# Altium schematic sheet [04] - USB PORTS.SchDoc
size A3; SheetNumber: 5; SheetTotal: 10
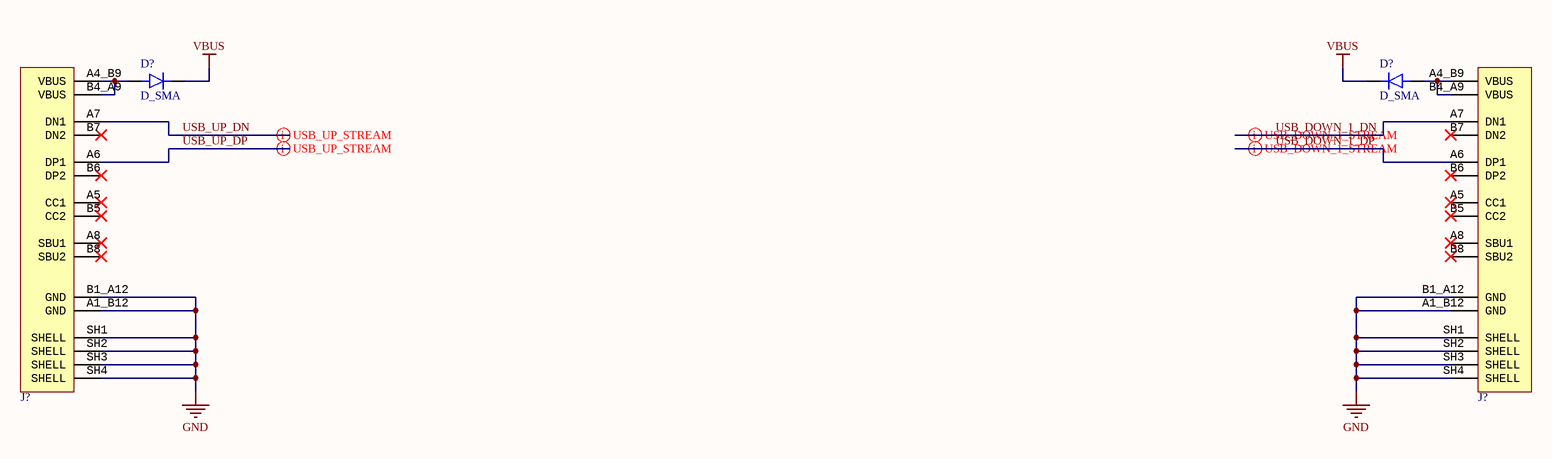
[diagram p0: [04] - USB PORTS.SchDoc]

## Parts
(Parts that share a designator on the sheet are numbered #1, #2 ... from top to bottom, then left to right.)
D?#1  D_SMA  [DO-214AC-2 (SMA)]
D?#2  D_SMA  [DO-214AC-2 (SMA)]
J?#1  CONN_USB_TYPEC_16PIN  [CONN_USB_TYPEC_16PIN]  (value not drawn)
J?#2  CONN_USB_TYPEC_16PIN  [CONN_USB_TYPEC_16PIN]  (value not drawn)

## Nets
GND: J?#1.A1_B12(GND) J?#1.B1_A12(GND) J?#1.SH1(SHELL) J?#1.SH2(SHELL) J?#1.SH3(SHELL) J?#1.SH4(SHELL) J?#2.A1_B12(GND) J?#2.B1_A12(GND) J?#2.SH1(SHELL) J?#2.SH2(SHELL) J?#2.SH3(SHELL) J?#2.SH4(SHELL)
VBUS: D?#1.K D?#2.K
USB_DOWN_1_DN: J?#2.A7(DN1)
USB_DOWN_1_DP: J?#2.A6(DP1)
USB_UP_DN: J?#1.A7(DN1)
USB_UP_DP: J?#1.A6(DP1)
NetD?#1_A: D?#1.A J?#1.A4_B9(VBUS) J?#1.B4_A9(VBUS)
NetD?#2_A: D?#2.A J?#2.A4_B9(VBUS) J?#2.B4_A9(VBUS)

Not connected (* = marked no-connect by the designer): J?#1 A5(CC1)* A8(SBU1)* B5(CC2)* B6(DP2)* B7(DN2)* B8(SBU2)*; J?#2 A5(CC1)* A8(SBU1)* B5(CC2)* B6(DP2)* B7(DN2)* B8(SBU2)*

## Layout directives
differential pair: USB_DOWN_1_DN, USB_DOWN_1_DP, USB_UP_DN, USB_UP_DP

## Library data of the parts
D?#1 D?#2 = D_SMA: Diode SMD SMA (DO-214AA)
J?#1 J?#2 = CONN_USB_TYPEC_16PIN: USB-C (USB TYPE-C) USB 2.0 Receptacle Connector 24 (16+8 Dummy) Position Surface Mount, Right Angle; Through Hole; MP: USB4105-GF-A; Value: USB-C 2.0 24-Pin (16+8 Dummy); Package: None; Price: None; Availability: Unavailable; ComponentLink1Description: Buy; ComponentLink1URL: https://www.thegioiic.com/cong-usb-cai-3-1-type-c-16-chan-thang-dan-smd; Supplier: N/A; Supplier PN: N/A; Supplier URL: *